# EasyEDA Pro project ProDoc_ChisFlash-MBCX-CQZ_2025-11-29.epro, schematic ChisFlash-MBCX-CQZ
Board Name: ChisFlash-MBCX-CQZ; Create Date: 2025-08-26; Page Name: 1; Project Name: ChisFlash-MBCX（时钟或震动单卡）; Schematic Name: ChisFlash-MBCX-CQZ; Update Date: 2025-10-30; Company: 嘉立创EDA; Page Size: A4; Version: V1.0
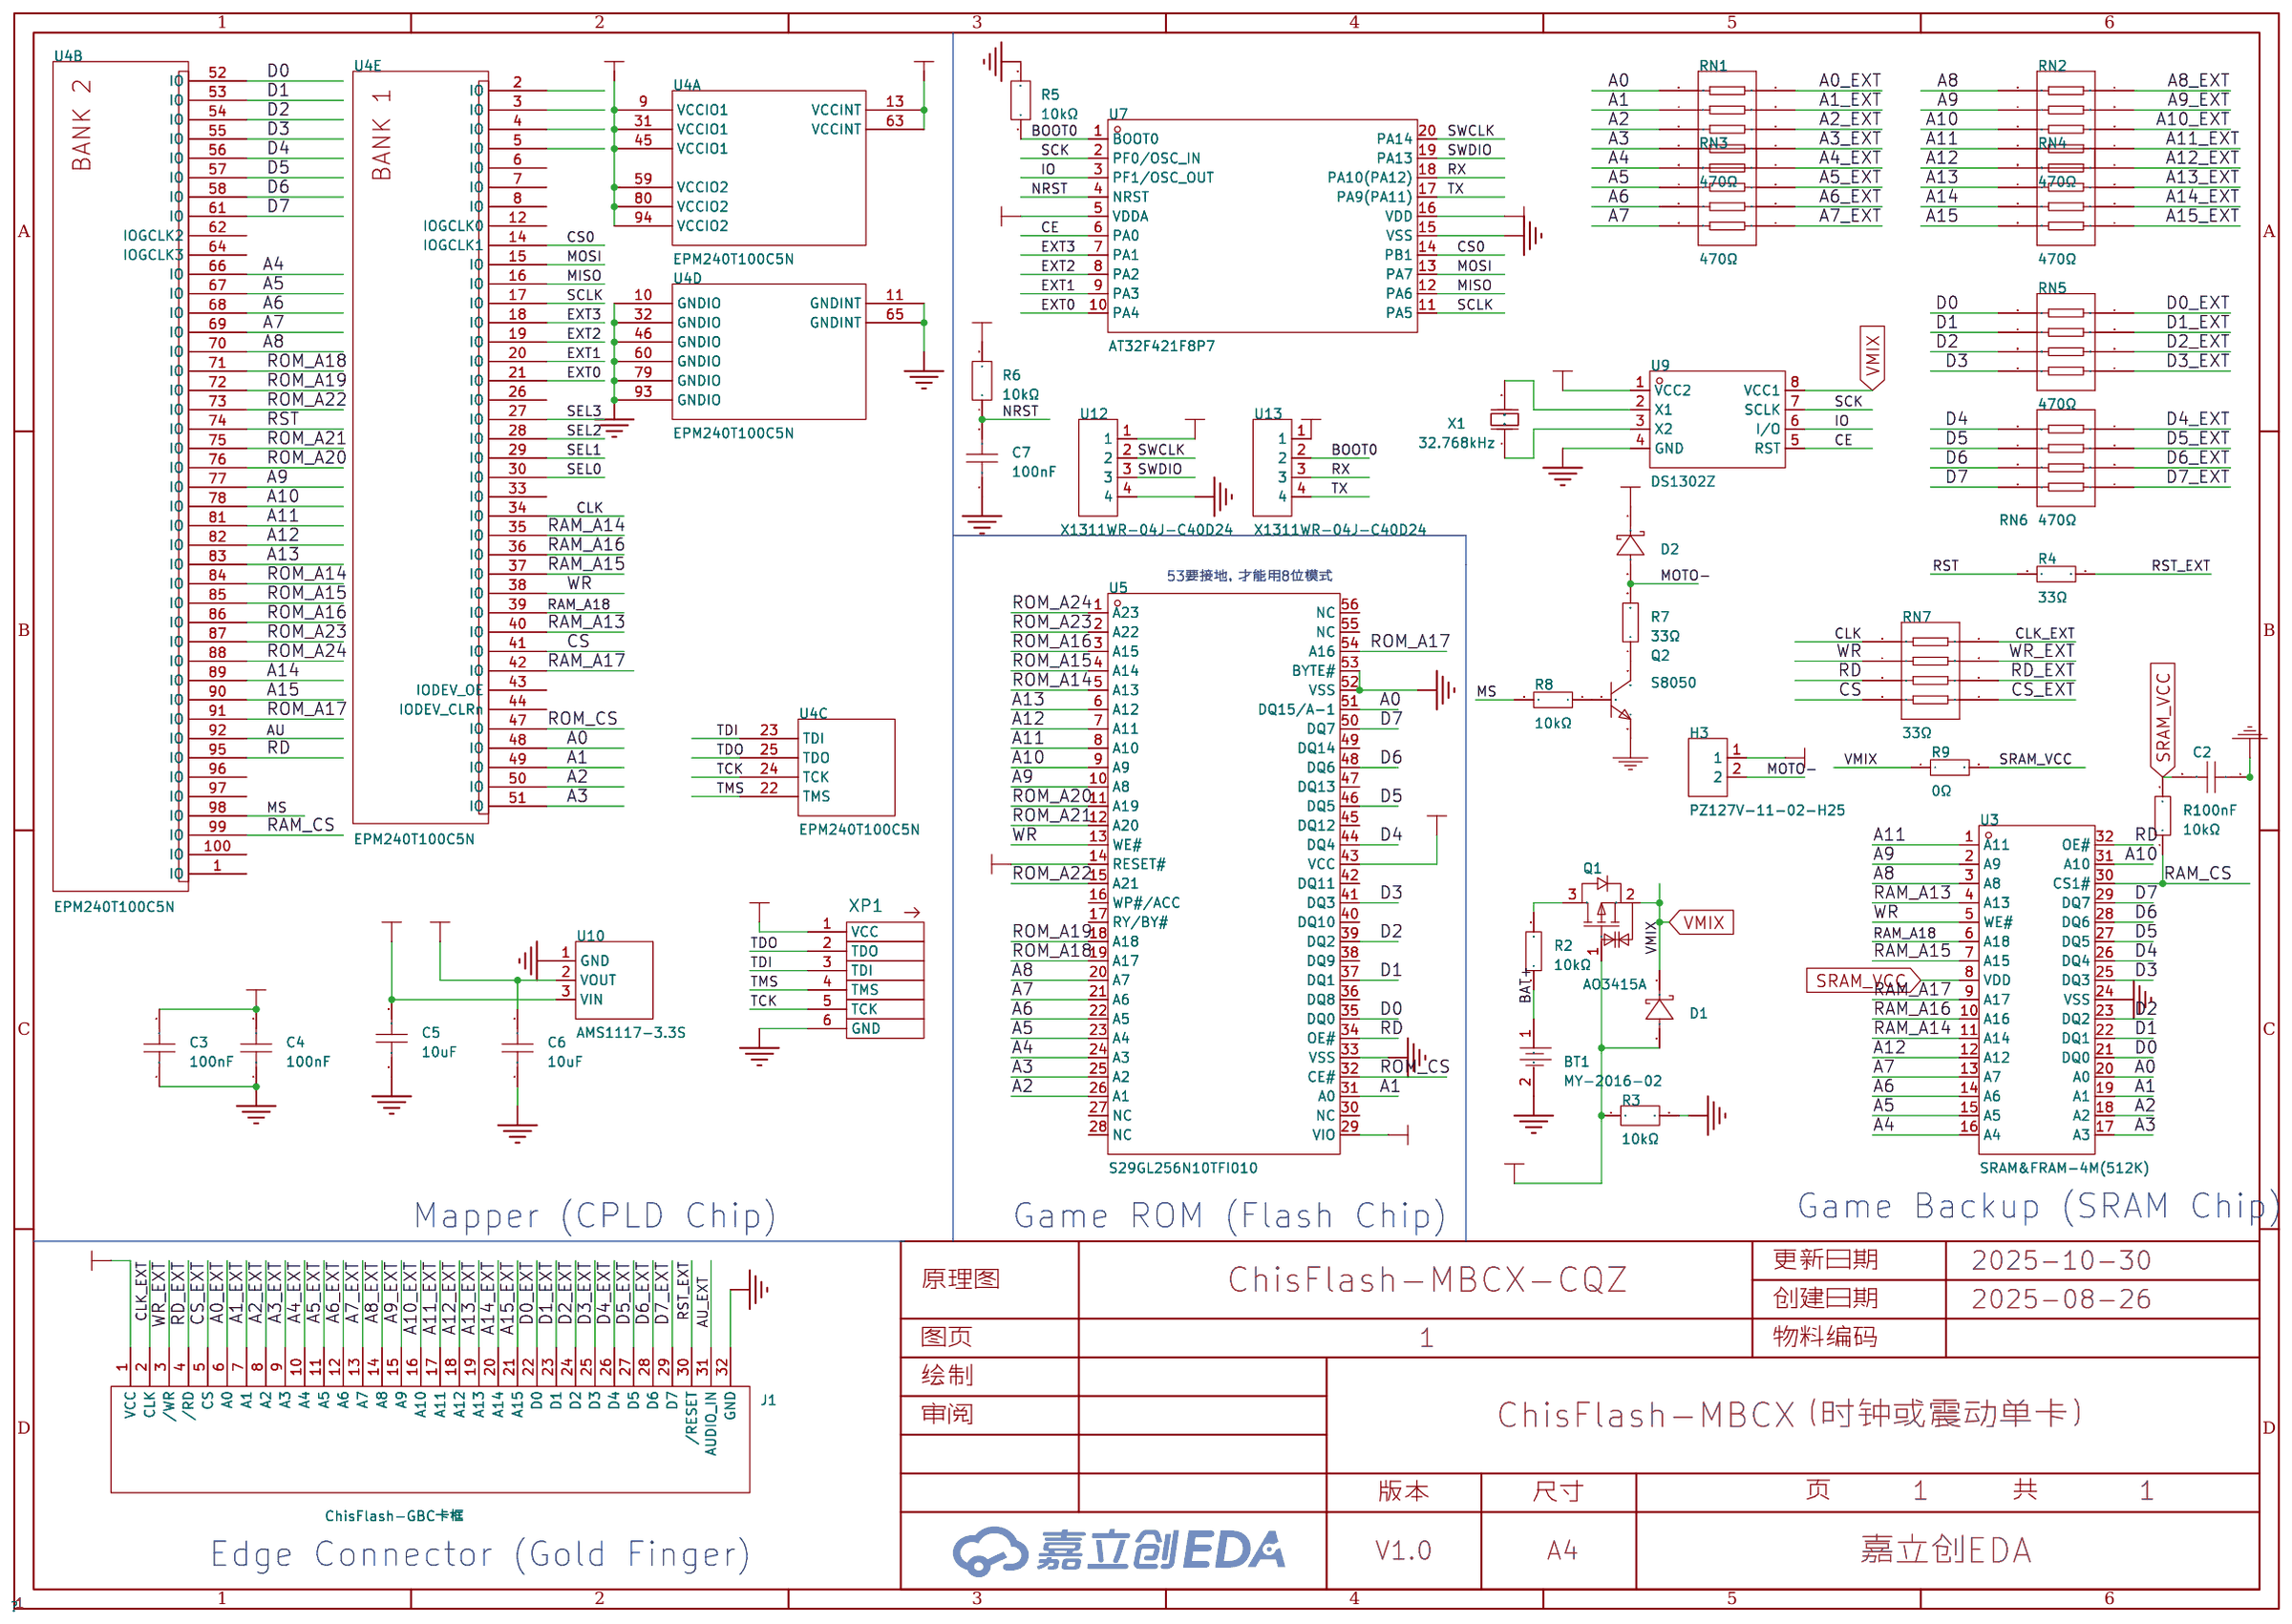
[diagram p0: schematic sheet]

## Parts
BT1  MY-2016-02  [BAT-SMD_MY-2032-08]
C2  100nF  [C0603]
C3  100nF  [C0603]
C4  100nF  [C0603]
C5  10uF  [C0603]
C6  10uF  [C0603]
C7  100nF  [C0603]
D1  RB751V-40  [SOD-323_L1.7-W1.3-LS2.6-RD-1]
D2  RB751V-40  [SOD-323_L1.7-W1.3-LS2.6-RD-1]
H3  PZ127V-11-02-H25  [HDR-TH_2P-P1.27-V-M-1]
J1  ChisFlash-GBC卡框  [ChisFlash-GBC卡框]
Q1  AO3415A  [SOT-23-3_L3.0-W1.7-P0.95-LS2.9-BR]
Q2  S8050  [SOT-23-3_L2.9-W1.3-P1.90-LS2.3-BR]
R1  10kΩ  [R0603]
R2  10kΩ  [R0603]
R3  10kΩ  [R0603]
R4  33Ω  [R0603]
R5  10kΩ  [R0603]
R6  10kΩ  [R0603]
R7  33Ω  [R0603]
R8  10kΩ  [R0603]
R9  0Ω  [R0603]
RN1  470Ω  [RES-ARRAY-SMD_0603-8P-L3.2-W1.6-BL]
RN2  470Ω  [RES-ARRAY-SMD_0603-8P-L3.2-W1.6-BL]
RN3  470Ω  [RES-ARRAY-SMD_0603-8P-L3.2-W1.6-BL]
RN4  470Ω  [RES-ARRAY-SMD_0603-8P-L3.2-W1.6-BL]
RN5  470Ω  [RES-ARRAY-SMD_0603-8P-L3.2-W1.6-BL]
RN6  470Ω  [RES-ARRAY-SMD_0603-8P-L3.2-W1.6-BL]
RN7  33Ω  [RES-ARRAY-SMD_0603-8P-L3.2-W1.6-BL]
U3  SRAM&FRAM-4M(512K)  [TSSOP-TSOP二合一_1]
U4  EPM240T100C5N  [TQFP-100_L14.0-W14.0-P0.50-LS16.0-BL]  (sections 1,2,3,4,5)
U5  S29GL256N10TFI010  [TSOP-56_L18.4-W14.0-P0.50-LS20.0-TL]
U7  AT32F421F8P7  [TSSOP-20_L6.5-W4.4-P0.65-LS6.4-BL]
U9  DS1302Z  [SOP-8_L4.9-W3.9-P1.27-LS6.0-BL-1]
U10  AMS1117-3.3S  [SOT-89-3_L4.5-W2.5-P1.50-LS4.2-BR]
U12  X1311WR-04J-C40D24  [HDR-TH_4P-P1.27-H-M-W7.0-N_1]
U13  X1311WR-04J-C40D24  [HDR-TH_4P-P1.27-H-M-W7.0-N_1]
X1  32.768kHz  [CRYSTAL-SMD_2P-L2.0-W1.2]
XP1  JTAG  [HDR-TH_6P-P1.27-V-M-1]  (no BOM)

## Library data of the parts
BT1 = MY-2016-02: 连接器类型:电池扣;适用电池规格:CR2016;触头材质:磷青铜;触点电镀:镍;工作温度范围:-25℃~+85℃;; LCSC Part Name: 电池扣 适用电池:CR2016; Supplier Part: C2979176; Manufacturer: MYOUNG(美阳); Supplier Footprint: SMD; JLCPCB Part Class: Extended Part; Datasheet: https://atta.szlcsc.com/upload/public/pdf/source/20220302/E5D3505CBEA02A6D68587A503653AA7C.pdf; Supplier: LCSC; Connector Type: 电池扣; Battery Type: CR2016; Contact Material: 磷青铜; Contact Plating: 镍; Operating Temperature Range: -25℃~+85℃
C2-C4 C7 = CGA0603X7R104K500JT: 容值:100nF;精度:±10%;额定电压:50V;材质(温度系数):X7R;; LCSC Part Name: 100nF ±10% 50V; Supplier Part: C6119867; Manufacturer: HRE(芯声); Supplier Footprint: 0603; JLCPCB Part Class: Extended Part; Supplier: LCSC; Tolerance: ±10%; Voltage Rated: 50V; Temperature Coefficient: X7R
C5 C6 = CL10A106MA8NRNC: 容值:10uF;精度:±20%;额定电压:25V;材质(温度系数):X5R;; LCSC Part Name: 10uF ±20% 25V; Supplier Part: C96446; Manufacturer: SAMSUNG(三星); Supplier Footprint: 0603; JLCPCB Part Class: 基础库; Datasheet: https://atta.szlcsc.com/upload/public/pdf/source/20160218/1457707763339.pdf; Supplier: LCSC; Tolerance: ±20%; Voltage Rated: 25V; Temperature Coefficient: X5R
D1 D2 = RB751V-40_C7502691: 二极管配置:独立式;正向压降(Vf):370mV@1mA;直流反向耐压(Vr):40V;平均整流电流(Io):30mA;; LCSC Part Name: 电压:40V 电流:30mA; Supplier Part: C7502691; Manufacturer: 宏迦橙; Supplier Footprint: SOD-323; JLCPCB Part Class: Extended Part; Datasheet: https://atta.szlcsc.com/upload/public/pdf/source/20230828/92E6C0C5321000DDFDA2BB61EC3C00B5.pdf; Supplier: LCSC; Diode Configuration: 独立式; Forward Voltage (Vf@If): 370mV@1mA; Reverse Voltage (Vr): 40V; Average Rectified Current (Io): 30mA; Reverse Leakage Current (Ir): 500nA; Peak forward surge current: 200mA
H3 = PZ127V-11-02-H25: 插针结构:1x2P;间距:1.27mm;行距:-;圆针/方针:方针;安装方式:直插;排数:单排;总PIN位数:2P;额定电流:1A;额定电压:-;配合针长度:2.9mm;塑高:2.5mm;端接针长度:2mm;触头材质:-;工作温度:-40℃~+105℃;颜色:黑色;; LCSC Part Name: 1x2P 间距:1.27mm 方针 直插; Supplier Part: C2832271; Manufacturer: XFCN(兴飞); Supplier Footprint: 插件,P=1.27mm; JLCPCB Part Class: 扩展库; Datasheet: https://atta.szlcsc.com/upload/public/pdf/source/20210514/C2832271_6AC4532CE31EE58DEDA5E55738438ACE.pdf; Supplier: LCSC; Pin Structure: 1x2P; Pitch: 1.27mm; Circluar Pins/Square Pins: 方针; Mounting Type: 直插; Number of Rows: 单排; Number of Pins: 2P; Current Rating: 1A; Length of Mating Pin: 2.9mm; Insulation Height: 2.5mm; Length of End Connection Pin: 2mm; Operating Temperature: -40℃~+105℃; Color: 黑色
J1 = ChisFlash-GBC卡框
Q1 = AO3415A_C347479: 类型:P沟道;漏源电压(Vdss):20V;连续漏极电流(Id):4A;功率(Pd):350mW;导通电阻(RDS(on)@Vgs,Id):50mΩ@4.5V,4A;阈值电压(Vgs(th)@Id):1V@250uA;; LCSC Part Name: P沟道 耐压:20V 电流:4A; Supplier Part: C347479; Manufacturer: UMW(友台半导体); Supplier Footprint: SOT-23; JLCPCB Part Class: 扩展库; Datasheet: https://atta.szlcsc.com/upload/public/pdf/source/20231109/CCE52C768C334A854304A623E33B204A.pdf; Supplier: LCSC; Type: P沟道; Drain Source Voltage (Vdss): 20V; Continuous Drain Current (Id): 4A; Power Dissipation (Pd): 350mW; Drain Source On Resistance (RDS(on)@Vgs,Id): 50mΩ@4.5V,4A; Gate Threshold Voltage (Vgs(th)@Id): 1V@250uA
Q2 = S8050_C20069125: 晶体管类型:NPN;集电极电流(Ic):500mA;集射极击穿电压(Vceo):25V;耗散功率(Pd):300mW;直流电流增益(hFE):120@50mA,1.0V;; LCSC Part Name: hFE:200-350，丝印:J3Y S8050; Supplier Part: C20069125; Manufacturer: 宏嘉诚; Supplier Footprint: SOT-23; JLCPCB Part Class: 扩展库; Datasheet: https://atta.szlcsc.com/upload/public/pdf/source/20250624/73EDA2AB79795B2EF6617BE5A1B52BD3.pdf; Supplier: LCSC; type: NPN; Current - Collector(Ic): 500mA; Collector - Emitter Voltage VCEO: 25V; Pd - Power Dissipation: 300mW; DC Current Gain: 120@50mA,1.0V; Transition frequency(fT): 100MHz; Current - Collector Cutoff: 100nA; Vce Saturation(VCE(sat)): 600mV@500mA,50mA; Operating Temperature: -55℃~+150℃; Emitter-Base Voltage(Vebo): 5V
R1 R2 R8 = 0603WAF1002T5E: 电阻类型:厚膜电阻;阻值:10kΩ;精度:±1%;功率:100mW;温度系数:±100ppm/℃;最大工作电压:75V;工作温度范围:-55℃~+155℃;; LCSC Part Name: 10kΩ ±1% 100mW; Supplier Part: C25804; Manufacturer: UNI-ROYAL(厚声); Supplier Footprint: 0603; JLCPCB Part Class: Basic Part; Datasheet: https://atta.szlcsc.com/upload/public/pdf/source/20200306/C422600_1E6D84923E4A46A82E41ADD87F860B5C.pdf; Supplier: LCSC; Type: 厚膜电阻; Tolerance: ±1%; Power(Watts): 100mW; Temperature Coefficient: ±100ppm/℃; Overload Voltage (Max): 75V; Operating Temperature Range: -55℃~+155℃; Resistance: 47K
R3 R5 R6 = RT0603BRD1010KL: 电阻类型:薄膜电阻;阻值:10kΩ;精度:±0.1%;功率:100mW;最大工作电压:75V;温度系数:±25ppm/℃;; LCSC Part Name: 薄膜电阻 10kΩ ±0.1% 100mW; Supplier Part: C2087321; Manufacturer: YAGEO(国巨); Supplier Footprint: 0603; JLCPCB Part Class: 扩展库; Datasheet: https://atta.szlcsc.com/upload/public/pdf/source/20200610/C326738_5639A9F1B6EB6E4AE2197577D3456E7F.pdf; Supplier: LCSC; Type: 薄膜电阻; Tolerance: ±0.1%; Power(Watts): 100mW; Overload Voltage (Max): 75V; Temperature Coefficient: ±25ppm/℃; Operating Temperature Range: -55℃~+155℃
R4 R7 = 0603WAF330JT5E: 电阻类型:厚膜电阻;阻值:33Ω;精度:±1%;功率:100mW;最大工作电压:75V;温度系数:±100ppm/℃;; LCSC Part Name: 33Ω ±1% 100mW 厚膜电阻; Supplier Part: C23140; Manufacturer: UNI-ROYAL(厚声); Supplier Footprint: 0603; Datasheet: https://atta.szlcsc.com/upload/public/pdf/source/20200306/C422600_1E6D84923E4A46A82E41ADD87F860B5C.pdf; Supplier: LCSC; Type: 厚膜电阻; Tolerance: ±1%; Power(Watts): 100mW; Overload Voltage (Max): 75V; Temperature Coefficient: ±100ppm/℃; Operating Temperature Range: -55℃~+155℃
R9 = 0603WAF0000T5E: 电阻类型:厚膜电阻;阻值:0Ω;精度:±1%;功率:100mW;工作电压:75V;温度系数:-;; LCSC Part Name: 0Ω ±1% 100mW 厚膜电阻; Supplier Part: C21189; Manufacturer: UNI-ROYAL(厚声); Supplier Footprint: 0603; JLCPCB Part Class: 基础库; Datasheet: https://item.szlcsc.com/datasheet/0603WAF0000T5E/21903.html; Supplier: LCSC; Type: 厚膜电阻; Tolerance: ±1%; Power(Watts): 100mW; Voltage-Supply(Max): 75V; Operating Temperature: -55℃~+155℃
RN1-RN6 = 4D03WGJ0471T5E: 电阻器数:4;阻值:470Ω;精度:±5%;单个元件功率:62.5mW;温度系数:±200ppm/℃;; LCSC Part Name: 470Ω ±5%; Supplier Part: C25510; Manufacturer: UNI-ROYAL(厚声); Supplier Footprint: 0603x4; JLCPCB Part Class: Extended Part; Datasheet: https://atta.szlcsc.com/upload/public/pdf/source/20191224/C474318_2527498AE30E813171187CCD28401A71.pdf; Supplier: LCSC; Number of Resistors: 4; Tolerance: ±5%; Power(Watts): 62.5mW; Temperature Coefficient: ±200ppm/℃; Number of Pins: 8
RN7 = 4D03WGF330JT5E: 电阻器数:4;阻值:33Ω;精度:±1%;单个元件功率:62.5mW;温度系数:±200ppm/℃;; LCSC Part Name: 33Ω ±1%; Supplier Part: C425214; Manufacturer: UNI-ROYAL(厚声); Supplier Footprint: 0603x4; JLCPCB Part Class: Extended Part; Datasheet: https://atta.szlcsc.com/upload/public/pdf/source/20191224/C474318_2527498AE30E813171187CCD28401A71.pdf; Supplier: LCSC; Number of Resistors: 4; Tolerance: ±1%; Power(Watts): 62.5mW; Temperature Coefficient: ±200ppm/℃; Number of Pins: 8
U3 = SRAM&FRAM-4M(512K)
U4 = EPM240T100C5N: 类型:其它PLD;逻辑门数量:-;逻辑单元数:-;逻辑阵列块数:240;; Supplier Part: C10041; Manufacturer: Intel/Altera; Supplier Footprint: TQFP-100(14x14); JLCPCB Part Class: 扩展库; Datasheet: https://atta.szlcsc.com/upload/public/pdf/source/20121123/1457706563537.pdf; Supplier: LCSC; Type: 其它PLD; Supply Voltage Range - VCCIO: 3.3V；2.5V; Logic Array Blocks: 240; Maximum Delay Time Tpd: 4.7ns; Operating Temperature Range: 0℃~+85℃
U5 = S29GL256N10TFI010: Supplier Part: C1349323; Supplier Footprint: TSOP-56-14.0mm; JLCPCB Part Class: 扩展库; Supplier: LCSC
U7 = AT32F421F8P7: LCSC Part Name: 基于ARM 32位Cortex-M4微控制器，配有闪存、sLib、定时器、ADC、比较器、通信接口; Supplier Part: C2827821; Manufacturer: ARTERY(雅特力); Supplier Footprint: TSSOP-20; JLCPCB Part Class: 扩展库; Datasheet: https://item.szlcsc.com/datasheet/AT32F421F8P7/2974739.html; Supplier: LCSC
U9 = DS1302Z: 接口:三线串行接口;; Supplier Part: C2900599; Manufacturer: JSMSEMI(杰盛微); Supplier Footprint: SOP-8; JLCPCB Part Class: 扩展库; Datasheet: https://atta.szlcsc.com/upload/public/pdf/source/20240105/2EECAA23DA6554B4727AEEBA1516F833.pdf; Supplier: LCSC; Interface: 三线串行接口; Operating Voltage: 2V~5.5V; Supply Current: 1.2mA; Operating Temperature: 0℃~+70℃
U10 = AMS1117-3.3S_C347256: 输出类型:固定;工作电压:18V;输出电压:3.3V;输出电流:1A;电源纹波抑制比(PSRR):60dB@(120Hz);输出极性:正极;; LCSC Part Name: 输出:3.3V 电流:1A 耐压:18V; Supplier Part: C347256; Manufacturer: UMW(友台半导体); Supplier Footprint: SOT-89; JLCPCB Part Class: 扩展库; Datasheet: https://atta.szlcsc.com/upload/public/pdf/source/20241218/BAF0263FA2E44BCD8AF41AA4FA04EFAA.pdf; Supplier: LCSC; Output Type: 固定; Voltage - Supply: 18V; Output Voltage: 3.3V; Output Current: 1A; Power Supply Rejection Ratio (PSRR): 60dB@(120Hz); Voltage Dropout: 1.3V@(1A); Features: 过流保护; Output Configuration: 正极; Number of Outputs: 1
U12 U13 = X1311WR-04J-C40D24: 插针结构:1x4P;间距:1.27mm;行距:1.27mm;圆针/方针:方针;排数:单排;总PIN位数:4P;额定电流:3A;额定电压:250V;配合针长度:-;塑高:1mm;端接针长度:-;触头材质:黄铜;触头镀层:金;工作温度:-40℃~+105℃;颜色:黑色;; LCSC Part Name: 1x4P 间距:1.27mm 方针; Supplier Part: C5243723; Manufacturer: XKB Connection(中国星坤); Supplier Footprint: 弯插,P=1.27mm; JLCPCB Part Class: 扩展库; Datasheet: https://atta.szlcsc.com/upload/public/pdf/source/20221103/463EBF4682347C53FAF1D6FB9D54EC17.pdf; Supplier: LCSC; Pin Structure: 1x4P; Pitch: 1.27mm; Row Spacing: 1.27mm; Circluar Pins/Square Pins: 方针; Number of Rows: 单排; Number of Pins: 4P; Current Rating: 3A; Voltage Rating (Max): 250V; Insulation Height: 1mm; Contact Material: 黄铜; Contact Plating: 金; Operating Temperature: -40℃~+105℃; Color: 黑色
X1 = XKHEL89CGI-112YLC-32.768K: 晶振类型:贴片晶振;频率:32.768kHz;常温频差:±20ppm;负载电容:12.5pF;频率稳定度:±30ppm;; LCSC Part Name: YSX2012SK 32.768KHZ 2P 2012 12.5PF ±20PPM -40~85℃; Supplier Part: C7500573; Manufacturer: YXC(扬兴晶振); Supplier Footprint: SMD2012-2P; JLCPCB Part Class: 扩展库; Datasheet: https://item.szlcsc.com/datasheet/XKHEL89CGI-112YLC-32.768K/8579117.html; Supplier: LCSC; Type: 贴片晶振; Normal temperature Frequency Tolerance: ±20ppm; Load Capacitance: 12.5pF; Frequency Stability: ±30ppm; Operating Temperature: -40℃~+85℃
XP1 = jtag

## Nets
+3V3: C3.2 C4.2 C6.2 D1.2(A) D2.1(K) H3.1 Q1.1(G) R3.1 R6.2 U4.9(VCCIO1) U4.13(VCCINT) U4.31(VCCIO1) U4.45(VCCIO1) U4.59(VCCIO2) U4.63(VCCINT) U4.80(VCCIO2) U4.94(VCCIO2) U5.14(RESET#) U5.29(VIO) U5.43(VCC) U7.5(VDDA) U7.16(VDD) U9.1(VCC2) U10.2(VOUT) U12.1 U13.1 XP1.1(VCC)
+5V: C5.2 J1.1(VCC) U10.3(VIN)
GND: BT1.2 C2.1 C3.1 C4.1 C5.1 C6.1 C7.2 J1.32(GND) Q2.2(E) R3.2 R5.2 U3.24(VSS) U4.10(GNDIO) U4.11(GNDINT) U4.32(GNDIO) U4.46(GNDIO) U4.60(GNDIO) U4.65(GNDINT) U4.79(GNDIO) U4.93(GNDIO) U5.33(VSS) U5.52(VSS) U5.53(BYTE#) U7.15(VSS) U9.4(GND) U10.1(GND) U12.4 XP1.6(GND)
A0: RN1.8 U3.20(A0) U4.48(IO) U5.51(DQ15/A-1)
A0_EXT: J1.6(A0) RN1.1
A1: RN1.7 U3.19(A1) U4.49(IO) U5.31(A0)
A1_EXT: J1.7(A1) RN1.2
A2: RN1.6 U3.18(A2) U4.50(IO) U5.26(A1)
A2_EXT: J1.8(A2) RN1.3
A3: RN1.5 U3.17(A3) U4.51(IO) U5.25(A2)
A3_EXT: J1.9(A3) RN1.4
A4: RN3.8 U3.16(A4) U4.66(IO) U5.24(A3)
A4_EXT: J1.10(A4) RN3.1
A5: RN3.7 U3.15(A5) U4.67(IO) U5.23(A4)
A5_EXT: J1.11(A5) RN3.2
A6: RN3.6 U3.14(A6) U4.68(IO) U5.22(A5)
A6_EXT: J1.12(A6) RN3.3
A7: RN3.5 U3.13(A7) U4.69(IO) U5.21(A6)
A7_EXT: J1.13(A7) RN3.4
A8: RN2.8 U3.3(A8) U4.70(IO) U5.20(A7)
A8_EXT: J1.14(A8) RN2.1
A9: RN2.7 U3.2(A9) U4.77(IO) U5.10(A8)
A9_EXT: J1.15(A9) RN2.2
A10: RN2.6 U3.31(A10) U4.78(IO) U5.9(A9)
A10_EXT: J1.16(A10) RN2.3
A11: RN2.5 U3.1(A11) U4.81(IO) U5.8(A10)
A11_EXT: J1.17(A11) RN2.4
A12: RN4.8 U3.12(A12) U4.82(IO) U5.7(A11)
A12_EXT: J1.18(A12) RN4.1
A13: RN4.7 U4.83(IO) U5.6(A12)
A13_EXT: J1.19(A13) RN4.2
A14: RN4.6 U4.89(IO)
A14_EXT: J1.20(A14) RN4.3
A15: RN4.5 U4.90(IO)
A15_EXT: J1.21(A15) RN4.4
AU: U4.92(IO)
AU_EXT: J1.31(AUDIO_IN)
BAT+: BT1.1 R2.1
BATQ1: Q1.3(D) R2.2
BOOT0: R5.1 U7.1(BOOT0) U13.2
CE: U7.6(PA0) U9.5(RST)
CLK: RN7.8 U4.34(IO)
CLK_EXT: J1.2(CLK) RN7.1
CS: RN7.5 U4.41(IO)
CS0: U4.14(IOGCLK1) U7.14(PB1)
CS_EXT: J1.5(CS) RN7.4
D0: RN5.8 U3.21(DQ0) U4.52(IO) U5.35(DQ0)
D0_EXT: J1.22(D0) RN5.1
D1: RN5.7 U3.22(DQ1) U4.53(IO) U5.37(DQ1)
D1_EXT: J1.23(D1) RN5.2
D2: RN5.6 U3.23(DQ2) U4.54(IO) U5.39(DQ2)
D2_EXT: J1.24(D2) RN5.3
D3: RN5.5 U3.25(DQ3) U4.55(IO) U5.41(DQ3)
D3_EXT: J1.25(D3) RN5.4
D4: RN6.8 U3.26(DQ4) U4.56(IO) U5.44(DQ4)
D4_EXT: J1.26(D4) RN6.1
D5: RN6.7 U3.27(DQ5) U4.57(IO) U5.46(DQ5)
D5_EXT: J1.27(D5) RN6.2
D6: RN6.6 U3.28(DQ6) U4.58(IO) U5.48(DQ6)
D6_EXT: J1.28(D6) RN6.3
D7: RN6.5 U3.29(DQ7) U4.61(IO) U5.50(DQ7)
D7_EXT: J1.29(D7) RN6.4
EXT0: U4.21(IO) U7.10(PA4)
EXT1: U4.20(IO) U7.9(PA3)
EXT2: U4.19(IO) U7.8(PA2)
EXT3: U4.18(IO) U7.7(PA1)
IO: U7.3(PF1/OSC_OUT) U9.6(I/O)
MISO: U4.16(IO) U7.12(PA6)
MOSI: U4.15(IO) U7.13(PA7)
MOTO-: D2.2(A) H3.2 R7.2
MS: R8.2 U4.98(IO)
NRST: C7.1 R6.1 U7.4(NRST)
RAM_A13: U3.4(A13) U4.40(IO)
RAM_A14: U3.11(A14) U4.35(IO)
RAM_A15: U3.7(A15) U4.37(IO)
RAM_A16: U3.10(A16) U4.36(IO)
RAM_A17: U3.9(A17) U4.42(IO)
RAM_A18: U3.6(A18) U4.39(IO)
RAM_CS: R1.1 U3.30(CS1#) U4.99(IO)
RD: RN7.6 U3.32(OE#) U4.95(IO) U5.34(OE#)
RD_EXT: J1.4(/RD) RN7.3
ROM_A14: U4.84(IO) U5.5(A13)
ROM_A15: U4.85(IO) U5.4(A14)
ROM_A16: U4.86(IO) U5.3(A15)
ROM_A17: U4.91(IO) U5.54(A16)
ROM_A18: U4.71(IO) U5.19(A17)
ROM_A19: U4.72(IO) U5.18(A18)
ROM_A20: U4.76(IO) U5.11(A19)
ROM_A21: U4.75(IO) U5.12(A20)
ROM_A22: U4.73(IO) U5.15(A21)
ROM_A23: U4.87(IO) U5.2(A22)
ROM_A24: U4.88(IO) U5.1(A23)
ROM_CS: U4.47(IO) U5.32(CE#)
RST: R4.1 U4.74(IO)
RST_EXT: J1.30(/RESET) R4.2
RX: U7.18(PA10(PA12)) U13.3
SCK: U7.2(PF0/OSC_IN) U9.7(SCLK)
SCLK: U4.17(IO) U7.11(PA5)
SEL0: U4.30(IO)
SEL1: U4.29(IO)
SEL2: U4.28(IO)
SEL3: U4.27(IO)
SRAM_VCC: C2.2 R1.2 R9.2 U3.8(VDD)
SWCLK: U7.20(PA14) U12.2
SWDIO: U7.19(PA13) U12.3
TCK: U4.24(TCK) XP1.5(TCK)
TDI: U4.23(TDI) XP1.3(TDI)
TDO: U4.25(TDO) XP1.2(TDO)
TMS: U4.22(TMS) XP1.4(TMS)
TX: U7.17(PA9(PA11)) U13.4
VMIX: D1.1(K) Q1.2(S) R9.1 U9.8(VCC1)
WR: RN7.7 U3.5(WE#) U4.38(IO) U5.13(WE#)
WR_EXT: J1.3(/WR) RN7.2
$1N55028: U9.2(X1) X1.2(OSC2)
$1N55030: U9.3(X2) X1.1(OSC1)
$1N55996: Q2.3(C) R7.1
$1N56050: Q2.1(B) R8.1

Not connected (* = marked no-connect by the designer): U4 1(IO) 2(IO) 3(IO) 4(IO) 5(IO) 6(IO) 7(IO) 8(IO) 12(IOGCLK0) 26(IO) 33(IO) 43(IODEV_OE) 44(IODEV_CLRn) 62(IOGCLK2) 64(IOGCLK3) 96(IO) 97(IO) 100(IO); U5 16(WP#/ACC) 17(RY/BY#) 27(NC) 28(NC) 30(NC) 36(DQ8) 38(DQ9) 40(DQ10) 42(DQ11) 45(DQ12) 47(DQ13) 49(DQ14) 55(NC) 56(NC)

## Notes on the sheet
- 53要接地，才能用8位模式
- Mapper (CPLD Chip)
- Game ROM (Flash Chip)
- Game Backup (SRAM Chip)
- Edge Connector (Gold Finger)
